# Altium schematic sheet RS485 Network.SchDoc: RS485 Network
size 292 x 193 mm; SheetNumber: 14; SheetTotal: 21
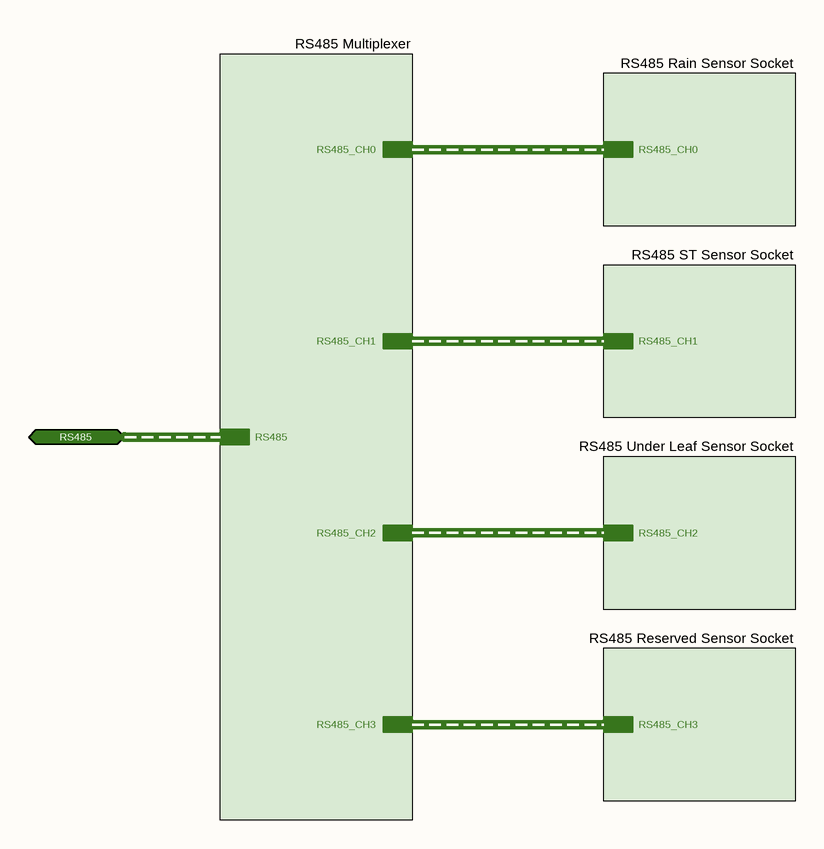
[diagram p0: RS485 Network.SchDoc]

## Sub-sheets
RS485 Multiplexer = RS485 Multiplexer.SchDoc: RS485_CH3 (harness RS485_CH3), RS485_CH0 (harness RS485_CH0), RS485 (harness RS485), RS485_CH2 (harness RS485_CH2), RS485_CH1 (harness RS485_CH1)
RS485 Rain Sensor Socket = RS485 Rain Sensor Socket.SchDoc: RS485_CH0 (harness RS485_CH0)
RS485 Reserved Sensor Socket = RS485 Reserved Sensor Socket.SchDoc: RS485_CH3 (harness RS485_CH3)
RS485 ST Sensor Socket = RS485 Soil Temperature Sensor Socket.SchDoc: RS485_CH1 (harness RS485_CH1)
RS485 Under Leaf Sensor Socket = RS485 Under Leaf Sensor Socket.SchDoc: RS485_CH2 (harness RS485_CH2)

## Ports
RS485 (bidir, harness RS485)

## Buses and harness runs
harness port RS485 = sheet RS485 Multiplexer/RS485
harness sheet RS485 Multiplexer/RS485_CH0 = sheet RS485 Rain Sensor Socket/RS485_CH0
harness sheet RS485 Multiplexer/RS485_CH1 = sheet RS485 ST Sensor Socket/RS485_CH1
harness sheet RS485 Multiplexer/RS485_CH2 = sheet RS485 Under Leaf Sensor Socket/RS485_CH2
harness sheet RS485 Multiplexer/RS485_CH3 = sheet RS485 Reserved Sensor Socket/RS485_CH3

## Notes on the sheet
- © 2021 All rights reserved.
  This document may not, in whole or in part, be copied, photocopied, reproduced, translated or converted to any electronic or machine readable from without prior written permission of Mehmet Günce Akkoyun.
  Engineer contact : akkoyun@me.com
- Property of
- Engineer :
- Date :
- Size :
- A4
- Time :
- Project :
- Page :
- /
- Customer :
- Product ID :
- Module ID :
- Version :
- File :
- Revision :